# Altium schematic sheet Buzzer, LED, Infrarrouge.SchDoc
size Letter; Organization: Cegep Limoilou; Address1: 1300, 8e Avenue; Address2: Québec, QC; Address3: Canada; Address4: G1J 5L5; Revision: Enseignants; SheetNumber: 7; SheetTotal: 9; Conception: Ilyes Gharmoul; Titre: Buzzer LED Infrarrouge; Modification: Ilyes G
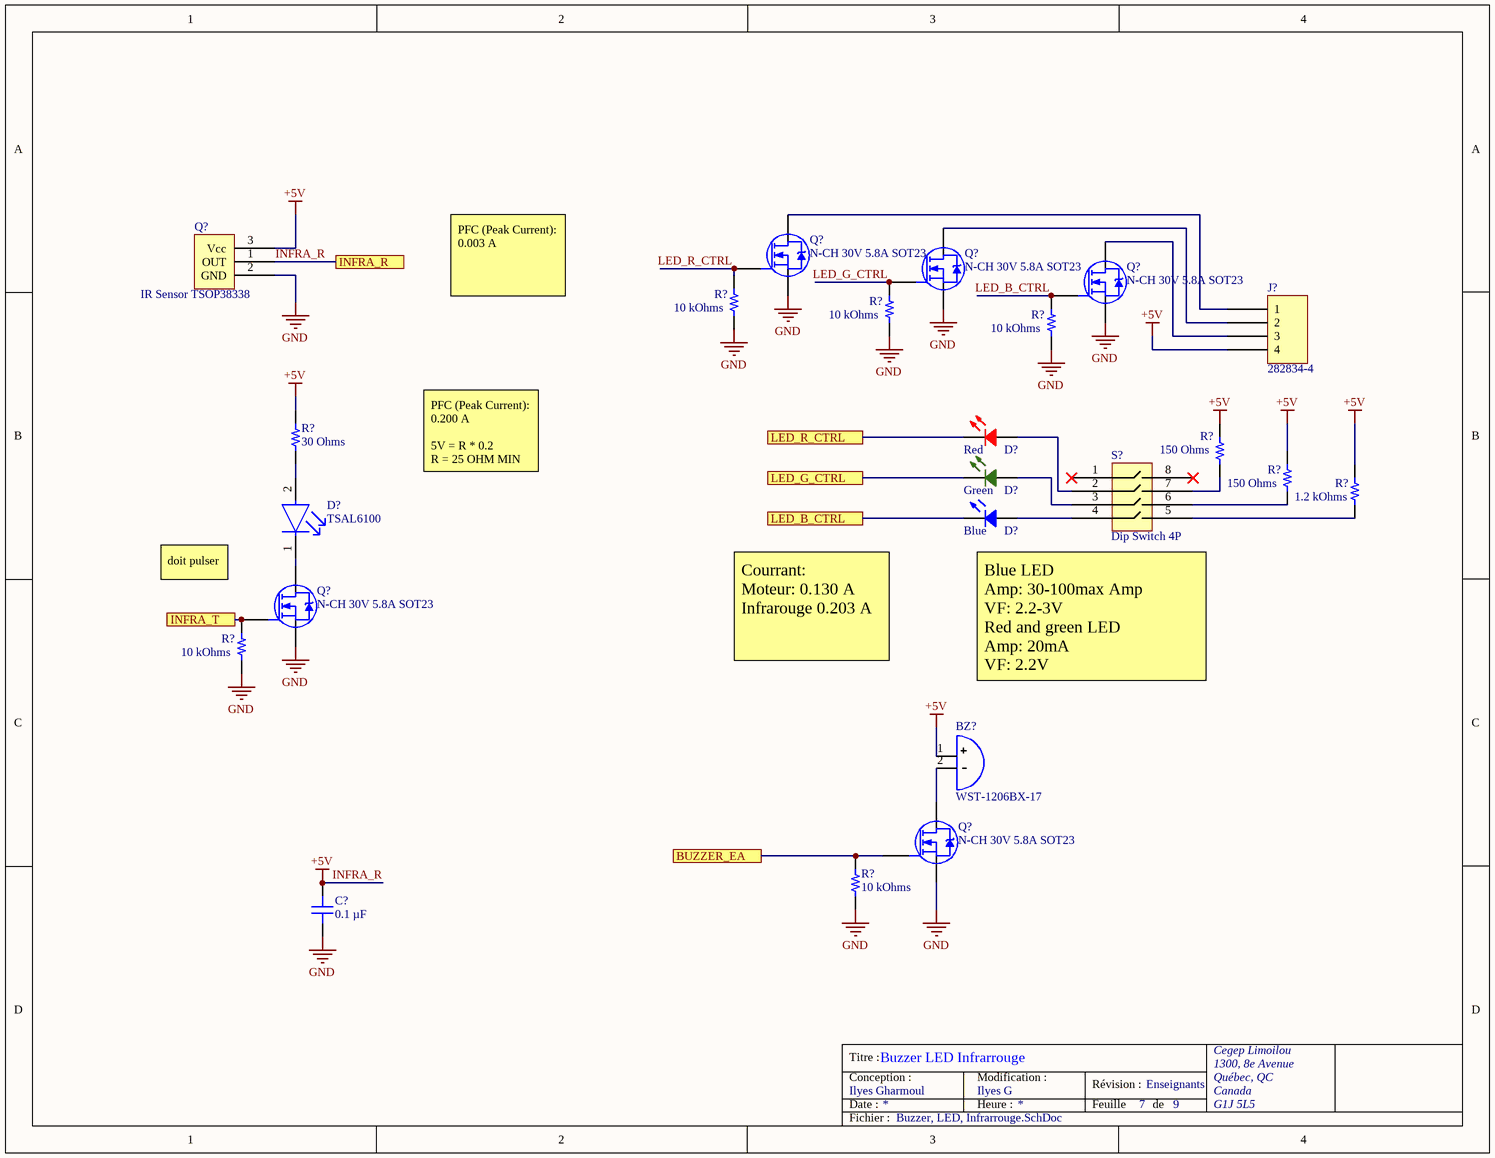
[diagram p0: Buzzer, LED, Infrarrouge.SchDoc]

## Parts
(Parts that share a designator on the sheet are numbered #1, #2 ... from top to bottom, then left to right.)
BZ?  WST-1206BX-17  [KCG1206-DSF]
C?  0.1 µF  [CAP 0603_1608]
D?#1  Red  [LED 0603_1608 RED]
D?#2  TSAL6100  [TSAL6100]
D?#3  Green  [LED 0603_1608 GREEN]
D?#4  Blue  [LED 0603_1608 BLUE]
J?  282834-4  [TE 282834-4]
Q?#1  N-CH 30V 5.8A SOT23  [N CHANNEL 30V 5.8A]
Q?#2  N-CH 30V 5.8A SOT23  [N CHANNEL 30V 5.8A]
Q?#3  N-CH 30V 5.8A SOT23  [N CHANNEL 30V 5.8A]
Q?#4  IR Sensor TSOP38338  [Header 1x3 100 mils]
Q?#5  N-CH 30V 5.8A SOT23  [N CHANNEL 30V 5.8A]
Q?#6  N-CH 30V 5.8A SOT23  [N CHANNEL 30V 5.8A]
R?#1  10 kOhms  [RES 0603_1608]
R?#2  10 kOhms  [RES 0603_1608]
R?#3  10 kOhms  [RES 0603_1608]
R?#4  30 Ohms  [RES 0603_1608]
R?#5  150 Ohms  [RES 0603_1608]
R?#6  150 Ohms  [RES 0603_1608]
R?#7  1.2 kOhms  [RES 0603_1608]
R?#8  10 kOhms  [RES 0603_1608]
R?#9  10 kOhms  [RES 0603_1608]
S?  Dip Switch 4P  [Dip Switch SMD]

## Ports
BUZZER_EA, INFRA_R, INFRA_T, LED_B_CTRL, LED_G_CTRL, LED_R_CTRL

## Nets
GND: C?.1 Q?#1.2(S) Q?#2.2(S) Q?#3.2(S) Q?#4.2(GND) Q?#5.2(S) Q?#6.2(S) R?#1.1 R?#2.1 R?#3.1 R?#8.1 R?#9.2
INFRA_R: BZ?.1 C?.2 J?.4 Q?#4.1(OUT) Q?#4.3(Vcc) R?#4.2 R?#5.2 R?#6.2 R?#7.2 ; port INFRA_R  [also labelled +5V]
BUZZER_EA: Q?#6.1(G) R?#9.1 ; port BUZZER_EA
INFRA_T: Q?#5.1(G) R?#8.2 ; port INFRA_T
LED_B_CTRL: Q?#3.1(G) R?#3.2
LED_B_CTRL: D?#4.C ; port LED_B_CTRL  [a separate net that carries the same name]
LED_G_CTRL: Q?#2.1(G) R?#2.2
LED_G_CTRL: D?#3.2 ; port LED_G_CTRL  [a separate net that carries the same name]
LED_R_CTRL: Q?#1.1(G) R?#1.2
LED_R_CTRL: D?#1.2 ; port LED_R_CTRL  [a separate net that carries the same name]
NetBZ?_2: BZ?.2 Q?#6.3(D)
NetD?#1_1: D?#1.1 S?.2
NetD?#2_1: D?#2.1(C) Q?#5.3(D)
NetD?#2_2: D?#2.2(A) R?#4.1
NetD?#3_1: D?#3.1 S?.3
NetD?#4_A: D?#4.A S?.4
NetJ?_1: J?.1 Q?#1.3(D)
NetJ?_2: J?.2 Q?#2.3(D)
NetJ?_3: J?.3 Q?#3.3(D)
NetR?#5_1: R?#5.1 S?.7
NetR?#6_1: R?#6.1 S?.6
NetR?#7_1: R?#7.1 S?.5

Not connected (* = marked no-connect by the designer): S? 1* 8*

## Notes on the sheet
- PFC (Peak Current): 0.003 A
- PFC (Peak Current): 0.200 A
  5V = R * 0.2
  R = 25 OHM MIN
- doit pulser
- Courrant:
  Moteur: 0.130 A
  Infrarouge 0.203 A
- Blue LED
  Amp: 30-100max Amp
  VF: 2.2-3V
  Red and green LED
  Amp: 20mA
  VF: 2.2V
- Titre :
- Conception :
- Date :
- Modification :
- Heure :
- Révision :
- Feuille
- de
- Fichier :

## Library data of the parts
BZ? = WST-1206BX-17: Buzzers Indicator, Internally Driven Magnetic 5 V 30mA 3.1kHz 83dB @ 5V, 10cm Through Hole PC Pins; Supplier 1: Digi-Key; Manufacturer Part Number 1: WST-1206BX-17; Supplier Part Number 1: 433-1081-ND; Manufacturer Part Number: WST-1206BX-17
C? = CS0603KRX7R7BB104: CAP CER 0.1UF 16V X7R 0603; manufacturer: Yageo; Tolerance: ±10%; Manufacturer Part Number: CS0603KRX7R7BB104; Value: 0.1 µF; Applications: Boardflex Sensitive; Capacitance: 0.1 µF; componentlink1description: Datasheet; componentlink1url: http://www.yageo.com/NewPortal/yageodocoutput?fileName=/pdf/MLCC/UPY-ST_NPOX7R_16V-to-3KV_5.pdf; componentlink2description: DigiKey Link; componentlink2url: https://www.digikey.com/en/products/detail/yageo/CS0603KRX7R7BB104/6097897; Device Package: 0603 (1608 Metric); Features: Soft Termination; lastupdated: 2023-04-04 19:08:57; Lifecycle Status: Active; Minimum Order: 1; Mounting Type: Surface Mount, MLCC; Operating Temperature: -55°C ~ 125°C; Package / Case: 0603 (1608 Metric); packaging: TapeAndReel; partid: 2286; Part Status: Active; price: 0.01; series: CS; Size / Dimension: 0.063" L x 0.031" W (1.60mm x 0.80mm); Supplier 1: DigiKey; Supplier Part Number 1: 311-3560-1-ND; Temperature Coefficient: X7R; Thickness (Max): 0.037" (0.95mm); Voltage - Rated: 16V
D?#1 = 0603 RED LED: Manufacturer Part Number: BL-HUB36A-AV-TRB; Manufacturer: American Bright Optoelectronics Corporation; Configuration: Standard; Current - Test: 20mA; Lens Color: Colorless; Lens Style: Rectangle with Flat Top; Lens Transparency: Clear; Millicandela Rating: 94mcd; Viewing Angle: 120°; Voltage - Forward (Vf) (Typ): 2.2V; Wavelength - Dominant: 632nm; Wavelength - Peak: 645nm; Color: Red; ComponentLink1Description: Datasheet; ComponentLink1URL: https://americanbrightled.com/pdffiles/smt/BL-HUB36A-AV-TRB.pdf; ComponentLink2Description: DigiKey Link; ComponentLink2URL: https://www.digikey.com/en/products/detail/american-bright-optoelectronics-corporation/BL-HUB36A-AV-TRB/9678174; Device Package: 0603 (1608 Metric); Height (Max): 0.70mm; LastUpdated: 2023-03-27 19:53:19; Lifecycle Status: Active; Minimum Order: 1; Mounting Type: Surface Mount; Package / Case: 0603 (1608 Metric); Packaging: TapeAndReel; PartId: 1020; Part Status: Active; Price: 0.04; Series: -; Size / Dimension: 1.60mm L x 0.80mm W; Supplier 1: DigiKey; Supplier Part Number 1: BL-HUB36A-AV-TRBCT-ND; Supplier Device Package: 0603; Value: Red
D?#2 = CMP-00123-1: Infrared (IR) Emitter 940nm 1.35V 100mA 80mW/sr @ 100mA 20° Radial, 5mm Dia (T 1 3/4); Manufacturer Part Number 1: TSAL6100
D?#3 = 5973316507F: LED GREEN 0603 SMD; Manufacturer: Dialight; Configuration: Standard; Current - Test: 20mA; Lens Color: 1.24mm; Lens Style: Round with Domed Top; Millicandela Rating: 34mcd; Voltage - Forward (Vf) (Typ): 2V; Wavelength - Dominant: 560nm; Manufacturer Part Number: 5973316507F; Color: Green; ComponentLink1Description: Datasheet; ComponentLink1URL: http://www.dialightsignalsandcomponents.com/Assets/Drawings/2D_Drawings_DrawingDetailedSpec/NewDrawings/C18371C.pdf; ComponentLink2Description: DigiKey Link; ComponentLink2URL: https://www.digikey.com/en/products/detail/dialight/5973316507F/9385428; Device Package: 0603 (1608 Metric); Height (Max): 1.24mm; LastUpdated: 2023-03-27 19:52:49; Lifecycle Status: Active; Minimum Order: 1; Mounting Type: Surface Mount; Package / Case: 0603 (1608 Metric); Packaging: TapeAndReel; PartId: 587; Part Status: Active; Price: 0.13; Series: 597; Size / Dimension: 1.60mm L x 0.80mm W; Supplier 1: DigiKey; Supplier Part Number 1: 350-4373-1-ND; Supplier Device Package: 0603; Value: Green
D?#4 = APT1608LVBC/D: Blue 470nm LED Indication - Discrete 2.65V 0603 (1608 Metric); Manufacturer: Vishay Lite-On; Manufacturer Part Number 1: APT1608LVBC/D; Manufacturer Part Number: APT1608LVBC/D; Component Type: LED; Supplier 1: Digi-Key; Supplier Part Number 1: 754-1933-1-ND
J? = 282834-4: TERM BLK 4P SIDE ENT 2.54MM PCB; Manufacturer: TE Connectivity AMP Connectors; Current: 10A; Mating Orientation: Horizontal with Board; Number of Levels: 1; Pitch: 0.100" (2.54mm); Positions Per Level: 4; Voltage: 150V; Wire Gauge: 16-30 AWG; Wire Termination: Screw - Rising Cage Clamp; Part Number: 282834-4; Color: Green; ComponentLink1Description: Datasheet; ComponentLink1URL: https://www.te.com/commerce/DocumentDelivery/DDEController?Action=srchrtrv&DocNm=282834&DocType=Customer+Drawing&DocLang=English; ComponentLink2Description: DigiKey Link; ComponentLink2URL: http://digikey.com/product-detail/en/te-connectivity-amp-connectors/282834-4/A98335-ND/1153265; LastUpdated: 2020-01-15 04:16:05; Lifecycle Status: Active; Minimum Order: 1; Mounting Type: Through Hole; Packaging: Bulk; Part Status: Active; Price: 2.68; Series: Buchanan; Supplier 1: DigiKey; Supplier Part Number 1: A98335-ND
Q?#1-Q?#3 Q?#5 Q?#6 = TRANS N-CHANNEL 30V 5.8A SOT23: N-Channel 5.8A (Tj) 350mW Surface Mount SOT-23; Manufacturer Part Number 1: SI3404-TP; Manufacturer: MCC; Source: IC_Component.SchLib; Design Item ID: TRANS N-CHANNEL 30V 5.8A SOT23; Component Type: Transistors; Supplier 1: Digi-Key; Supplier Part Number 1: DMN3051LDICT-ND
Q?#4 = CMP-00005-5: Ir Remote Receiver 38KHZ 45M 3-PIN; Manufacturer Part Number 1: TSOP38338
R?#1-R?#3 R?#8 = CMP0603-FX-1002ELF: RESHIGHPOWER 0603 10K 1% 1/4W TC; Manufacturer: Bourns Inc.; Power (Watts): 0.25W, 1/4W; Temperature Coefficient: ±100ppm/°C; Manufacturer Part Number: CMP0603-FX-1002ELF; Value: 10 kOhms; ComponentLink1Description: Datasheet; ComponentLink1URL: https://www.bourns.com/docs/Product-Datasheets/CMP.pdf; ComponentLink2Description: DigiKey Link; ComponentLink2URL: https://www.digikey.com/en/products/detail/bourns-inc/CMP0603-FX-1002ELF/12333644; Composition: Thick Film; Device Package: 0603 (1608 Metric); Features: Pulse Withstanding; Height - Seated (Max): 0.022" (0.55mm); LastUpdated: 2023-04-04 19:28:09; Lifecycle Status: Active; Minimum Order: 1; Number of Terminations: 2; Operating Temperature: -55°C ~ 155°C; Package / Case: 0603 (1608 Metric); Packaging: TapeAndReel; PartId: 64115; Part Status: Active; Price: 0.02; Resistance: 10 kOhms; Series: CMP; Size / Dimension: 0.063" L x 0.031" W (1.60mm x 0.80mm); Supplier 1: DigiKey; Supplier Part Number 1: 118-CMP0603-FX-1002ELFCT-ND; Supplier Device Package: 0603; Tolerance: ±1%
R?#4 = SG73P1JTTD30R0F: RES 30 OHM 1% 1/3W 0603; Manufacturer: KOA Speer Electronics, Inc.; Power (Watts): 0.333W, 1/3W; Temperature Coefficient: ±200ppm/°C; Manufacturer Part Number: SG73P1JTTD30R0F; Value: 30 Ohms; ComponentLink1Description: Datasheet; ComponentLink1URL: https://www.koaspeer.com/pdfs/SG73P.pdf; ComponentLink2Description: DigiKey Link; ComponentLink2URL: https://www.digikey.com/en/products/detail/koa-speer-electronics-inc/SG73P1JTTD30R0F/10188343; Composition: Thick Film; Device Package: 0603 (1608 Metric); Features: Automotive AEC-Q200, Pulse Withstanding; Height - Seated (Max): 0.022" (0.55mm); LastUpdated: 2023-04-03 19:29:12; Lifecycle Status: Active; Minimum Order: 1; Number of Terminations: 2; Operating Temperature: -55°C ~ 155°C; Package / Case: 0603 (1608 Metric); Packaging: TapeAndReel; PartId: 62768; Part Status: Active; Price: 0.01; Ratings: AEC-Q200; Resistance: 30 Ohms; Series: SG73P; Size / Dimension: 0.063" L x 0.031" W (1.60mm x 0.80mm); Supplier 1: DigiKey; Supplier Part Number 1: 2019-SG73P1JTTD30R0FCT-ND; Supplier Device Package: 0603; Tolerance: ±1%
R?#5 R?#6 = MCT0603MD1500BP100: RES SMD 150 OHM 0.1% 1/8W 0603; Manufacturer: Vishay Beyschlag; Power (Watts): 0.125W, 1/8W; Temperature Coefficient: ±25ppm/°C; Manufacturer Part Number: MCT0603MD1500BP100; Value: 150 Ohms; ComponentLink1Description: Datasheet; ComponentLink1URL: http://www.vishay.com/docs/28785/mcat_pre.pdf; ComponentLink2Description: DigiKey Link; ComponentLink2URL: http://digikey.com/product-detail/en/vishay-beyschlag/MCT0603MD1500BP100/MCT0603-150-MBCT-ND/2092134; Composition: Thin Film; Device Package: 0603 (1608 Metric); Features: Anti-Sulfur, Automotive AEC-Q200; Height - Seated (Max): 0.022" (0.55mm); LastUpdated: 2023-04-04 19:29:46; Lifecycle Status: Active; Minimum Order: 1; Number of Terminations: 2; Operating Temperature: -55°C ~ 155°C; Package / Case: 0603 (1608 Metric); Packaging: TapeAndReel; PartId: 5246; Part Status: Active; Price: 0.23; Ratings: AEC-Q200; Resistance: 150 Ohms; Series: MCT AT - Precision; Size / Dimension: 0.061" L x 0.033" W (1.55mm x 0.85mm); Supplier 1: DigiKey; Supplier Part Number 1: MCT0603-150-MBCT-ND; Supplier Device Package: 0603; Tolerance: ±0.1%
R?#7 = RT0603FRE071K2L: RES SMD 1.2K OHM 1% 1/10W 0603; Manufacturer: Yageo; Power (Watts): 0.1W, 1/10W; Temperature Coefficient: ±50ppm/°C; Manufacturer Part Number: RT0603FRE071K2L; Value: 1.2 kOhms; ComponentLink1Description: Datasheet; ComponentLink1URL: https://www.yageo.com/upload/media/product/productsearch/datasheet/rchip/PYu-RT_1-to-0.01_RoHS_L_11.pdf; ComponentLink2Description: DigiKey Link; ComponentLink2URL: https://www.digikey.com/en/products/detail/yageo/RT0603FRE071K2L/1075167; Composition: Thin Film; Device Package: 0603 (1608 Metric); Height - Seated (Max): 0.022" (0.55mm); LastUpdated: 2023-04-04 19:29:46; Lifecycle Status: Active; Minimum Order: 1; Number of Terminations: 2; Operating Temperature: -55°C ~ 155°C; Package / Case: 0603 (1608 Metric); Packaging: TapeAndReel; PartId: 5172; Part Status: Active; Price: 0.01; Resistance: 1.2 kOhms; Series: RT; Size / Dimension: 0.063" L x 0.031" W (1.60mm x 0.80mm); Supplier 1: DigiKey; Supplier Part Number 1: YAG5943CT-ND; Supplier Device Package: 0603; Tolerance: ±1%
R?#9 = ESR03EZPF1002: RES SMD 10K OHM 1% 1/4W 0603; Manufacturer: Rohm Semiconductor; Power (Watts): 0.25W, 1/4W; Temperature Coefficient: ±100ppm/°C; Manufacturer Part Number: ESR03EZPF1002; Value: 10 kOhms; ComponentLink1Description: Datasheet; ComponentLink1URL: https://www.rohm.com/datasheet/ESR01MZPF/esr-e; ComponentLink2Description: DigiKey Link; ComponentLink2URL: https://www.digikey.com/en/products/detail/rohm-semiconductor/ESR03EZPF1002/1983429; Composition: Thick Film; Device Package: 0603 (1608 Metric); Features: Automotive AEC-Q200, Pulse Withstanding; Height - Seated (Max): 0.022" (0.55mm); LastUpdated: 2023-03-27 19:26:49; Lifecycle Status: Active; Minimum Order: 1; Number of Terminations: 2; Operating Temperature: -55°C ~ 155°C; Package / Case: 0603 (1608 Metric); Packaging: TapeAndReel; PartId: 5466; Part Status: Active; Price: 0.02; Ratings: AEC-Q200; Resistance: 10 kOhms; Series: ESR; Size / Dimension: 0.063" L x 0.031" W (1.60mm x 0.80mm); Supplier 1: DigiKey; Supplier Part Number 1: RHM10KADCT-ND; Supplier Device Package: 0603; Tolerance: ±1%
S? = Dip Switch 4P: Dip Switch SPST 4 Position Surface Mount Slide (Standard) Actuator 25mA 24VDC; Manufacturer Part Number 1: DS04-254-2-04BK-SMT; Manufacturer: CUI; Source: IC_Component.SchLib; Design Item ID: Switch SLIDE SPDT 4 pos; Manufacturer Part Number: DS04-254-2-04BK-SMT; Component Type: Switches; Supplier 1: Digi-Key; Supplier Part Number 1: SW1120-ND